# EAGLE schematic Adaptor Board (EAGLE 6.2)
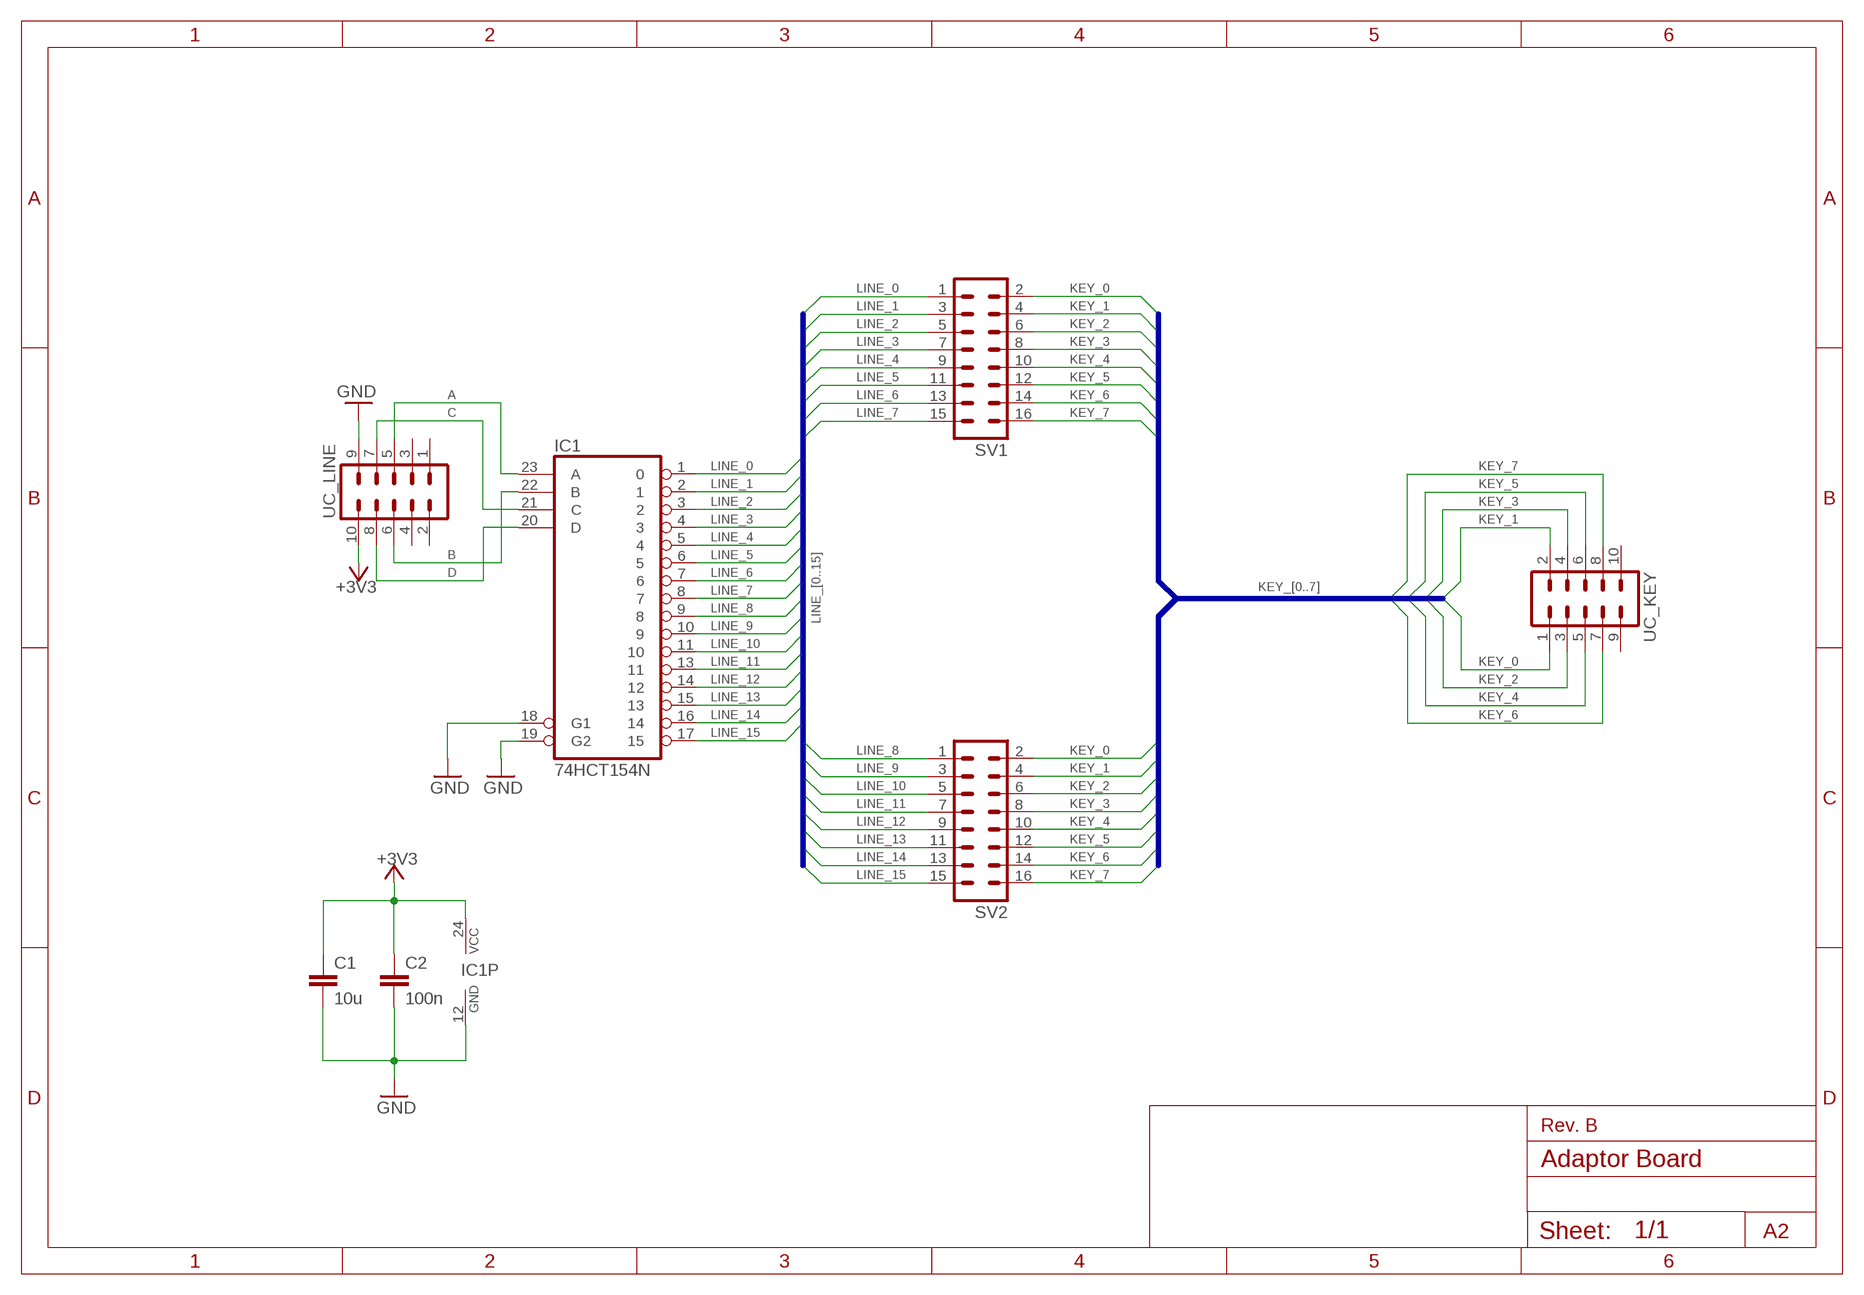
[diagram p0: schematic, sheet 1]

## Parts
C1  10u  C-EU025-024X044  [C025-024X044]
C2  100n  C-EU025-024X044  [C025-024X044]
IC1  74HCT154N  [DIL24-6]
SV1  ML16  [ML16]
SV2  ML16  [ML16]
UC_KEY  ML10  [ML10]
UC_LINE  ML10  [ML10]

## Nets
+3V3: C1.1 C2.1 IC1.24(VCC) UC_LINE.10
A: IC1.23(A) UC_LINE.5
B: IC1.22(B) UC_LINE.6
C: IC1.21(C) UC_LINE.7
D: IC1.20(D) UC_LINE.8
GND: C1.2 C2.2 IC1.12(GND) IC1.18(G1) IC1.19(G2) UC_LINE.9
KEY_0: SV1.2 SV2.2 UC_KEY.1
KEY_1: SV1.4 SV2.4 UC_KEY.2
KEY_2: SV1.6 SV2.6 UC_KEY.3
KEY_3: SV1.8 SV2.8 UC_KEY.4
KEY_4: SV1.10 SV2.10 UC_KEY.5
KEY_5: SV1.12 SV2.12 UC_KEY.6
KEY_6: SV1.14 SV2.14 UC_KEY.7
KEY_7: SV1.16 SV2.16 UC_KEY.8
LINE_0: IC1.1 SV1.1
LINE_1: IC1.2 SV1.3
LINE_2: IC1.3 SV1.5
LINE_3: IC1.4 SV1.7
LINE_4: IC1.5 SV1.9
LINE_5: IC1.6 SV1.11
LINE_6: IC1.7 SV1.13
LINE_7: IC1.8 SV1.15
LINE_8: IC1.9 SV2.1
LINE_9: IC1.10 SV2.3
LINE_10: IC1.11 SV2.5
LINE_11: IC1.13 SV2.7
LINE_12: IC1.14 SV2.9
LINE_13: IC1.15 SV2.11
LINE_14: IC1.16 SV2.13
LINE_15: IC1.17 SV2.15
Unconnected: UC_KEY.9 UC_KEY.10 UC_LINE.1 UC_LINE.2 UC_LINE.3 UC_LINE.4

## Buses
LINE_[0..15]
KEY_[0..7]

## Notes on the sheet
- Rev. B
- A2

## Library data of the parts
C1 C2 = rcl:C-EU: CAPACITOR, European symbol
IC1 = 74xx-eu:74*154: 4-line to 16-line data SELECTOR/MULTIPLEXER
SV1 SV2 = con-harting-ml:ML16: HARTING; OC_FARNELL: unknown; OC_NEWARK: unknown
UC_KEY UC_LINE = con-harting-ml:ML10: HARTING; OC_FARNELL: unknown; OC_NEWARK: unknown